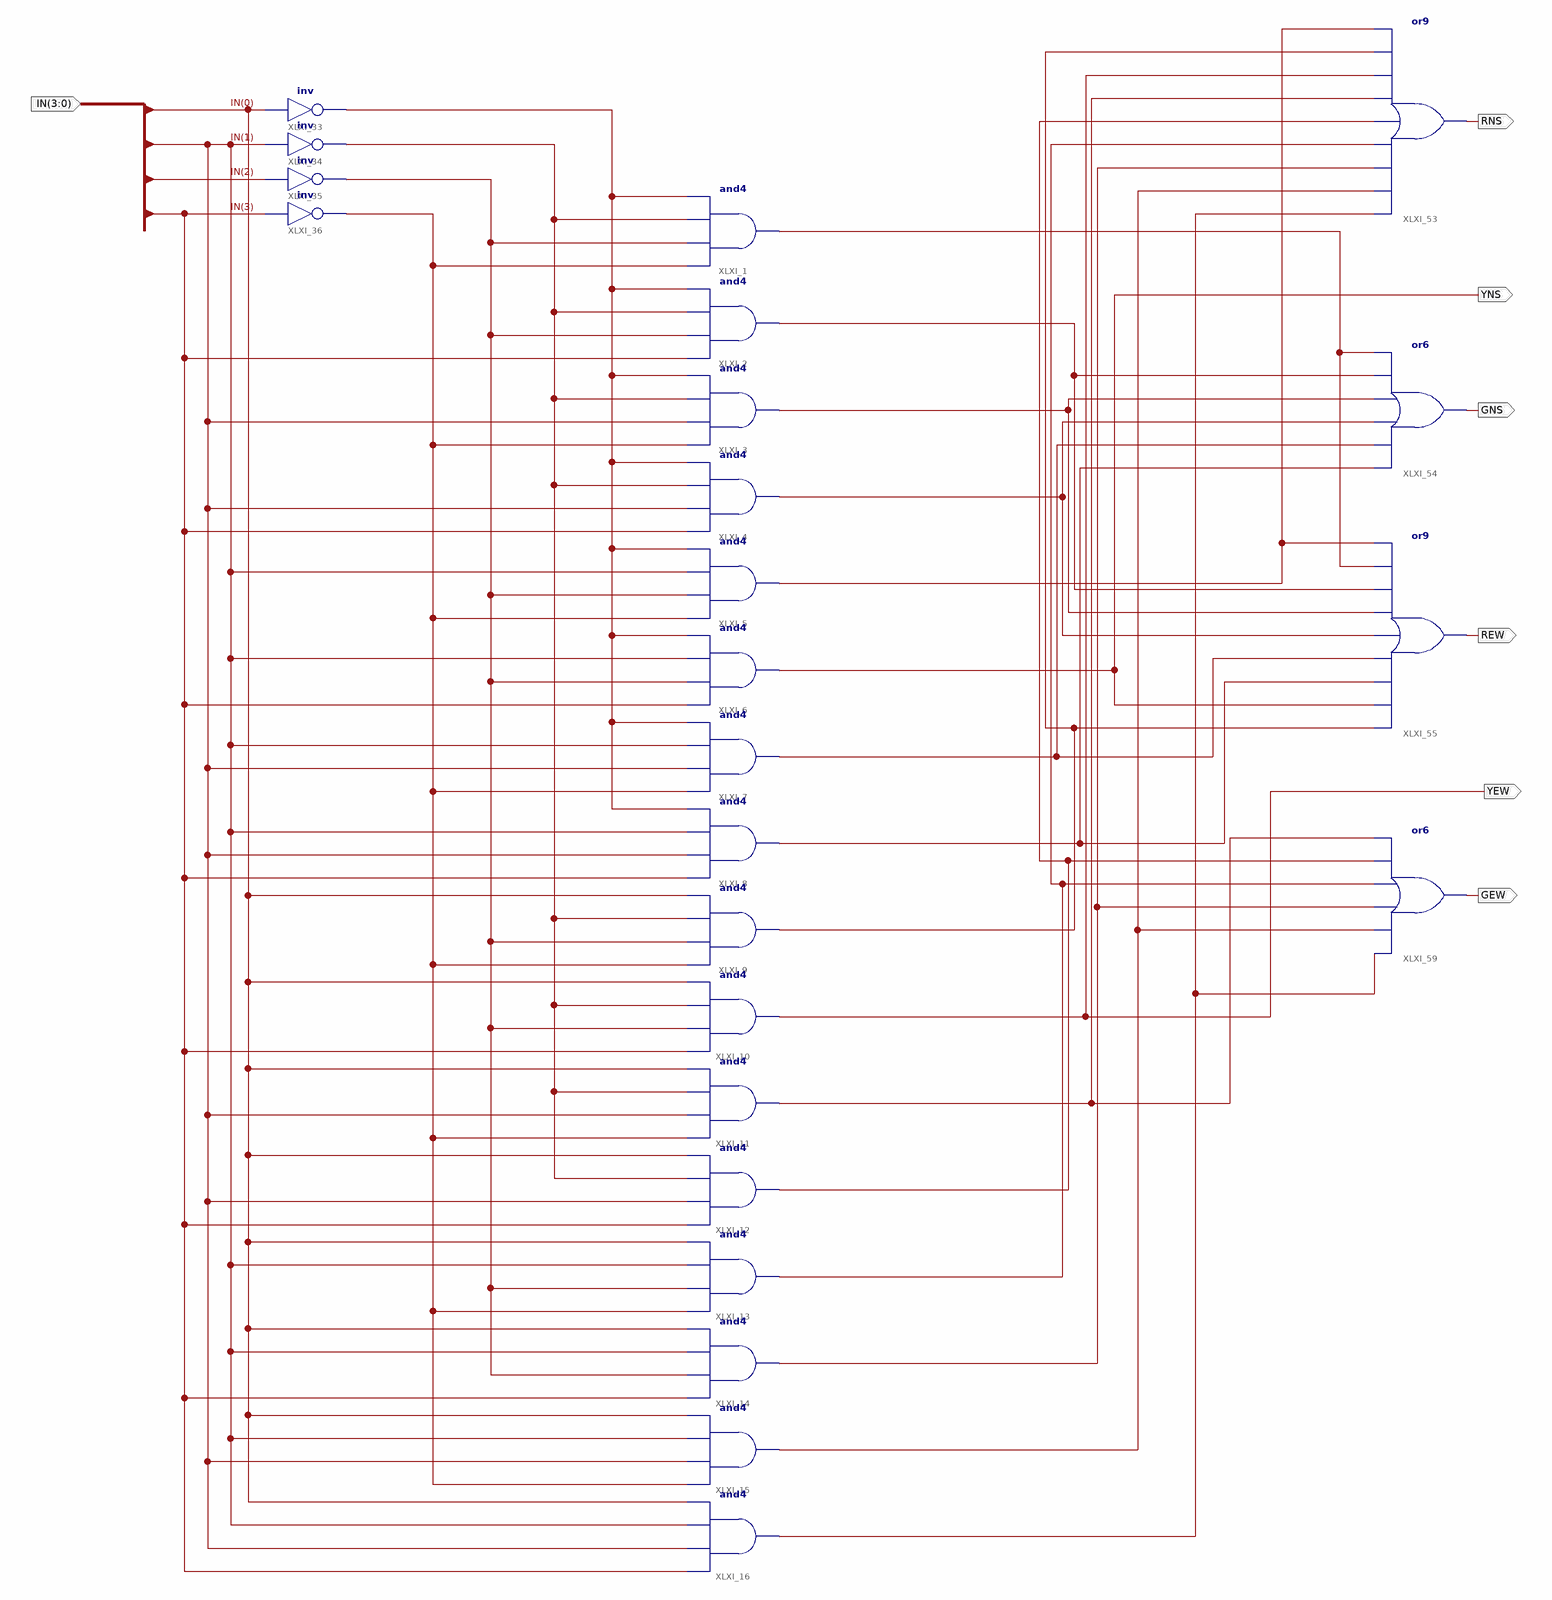
[diagram p0: schematic sheet 1]
// Xilinx ISE schematic C3_7.sch (kintex7) as structural Verilog: 24 symbols, 7 ports
module C3_7 (
  input  [3:0] IN,
  output RNS,
  output YNS,
  output GNS,
  output REW,
  output YEW,
  output GEW
);

  wire XLXN_6, XLXN_24, XLXN_40, XLXN_63, XLXN_94, XLXN_102, XLXN_106, XLXN_108, XLXN_110, XLXN_113,
       XLXN_114, XLXN_117, XLXN_119, XLXN_120, XLXN_121, XLXN_122, XLXN_124, XLXN_128;

  not XLXI_33 (XLXN_6, IN[0]);
  not XLXI_34 (XLXN_24, IN[1]);
  not XLXI_35 (XLXN_40, IN[2]);
  not XLXI_36 (XLXN_63, IN[3]);
  and XLXI_1 (XLXN_102, XLXN_63, XLXN_40, XLXN_24, XLXN_6);
  and XLXI_3 (XLXN_108, XLXN_63, IN[1], XLXN_24, XLXN_6);
  and XLXI_4 (XLXN_110, IN[3], IN[1], XLXN_24, XLXN_6);
  and XLXI_5 (XLXN_94, XLXN_63, XLXN_40, IN[1], XLXN_6);
  and XLXI_6 (YNS, IN[3], XLXN_40, IN[1], XLXN_6);
  and XLXI_7 (XLXN_113, XLXN_63, IN[1], IN[1], XLXN_6);
  and XLXI_8 (XLXN_114, IN[3], IN[1], IN[1], XLXN_6);
  and XLXI_9 (XLXN_117, XLXN_63, XLXN_40, XLXN_24, IN[0]);
  and XLXI_10 (YEW, IN[3], XLXN_40, XLXN_24, IN[0]);
  and XLXI_11 (XLXN_119, XLXN_63, IN[1], XLXN_24, IN[0]);
  and XLXI_12 (XLXN_120, IN[3], IN[1], XLXN_24, IN[0]);
  and XLXI_13 (XLXN_121, XLXN_63, XLXN_40, IN[1], IN[0]);
  and XLXI_14 (XLXN_122, IN[3], XLXN_40, IN[1], IN[0]);
  and XLXI_2 (XLXN_106, IN[3], XLXN_40, XLXN_24, XLXN_6);
  and XLXI_15 (XLXN_124, XLXN_63, IN[1], IN[1], IN[0]);
  and XLXI_16 (XLXN_128, IN[3], IN[1], IN[1], IN[0]);
  or XLXI_53 (RNS, XLXN_128, XLXN_124, XLXN_122, XLXN_121, XLXN_120, XLXN_119, YEW, XLXN_117, XLXN_94);
  or XLXI_54 (GNS, XLXN_114, XLXN_113, XLXN_110, XLXN_108, XLXN_106, XLXN_102);
  or XLXI_55 (REW, XLXN_117, YNS, XLXN_114, XLXN_113, XLXN_110, XLXN_108, XLXN_106, XLXN_102, XLXN_94);
  or XLXI_59 (GEW, XLXN_128, XLXN_124, XLXN_122, XLXN_121, XLXN_120, XLXN_119);
endmodule
